# Altium project Flight_controller v1.0.PrjPcb (part 3 of 3)

## Sheet Sensors.SchDoc
size A3; SheetNumber: 5; SheetTotal: 5
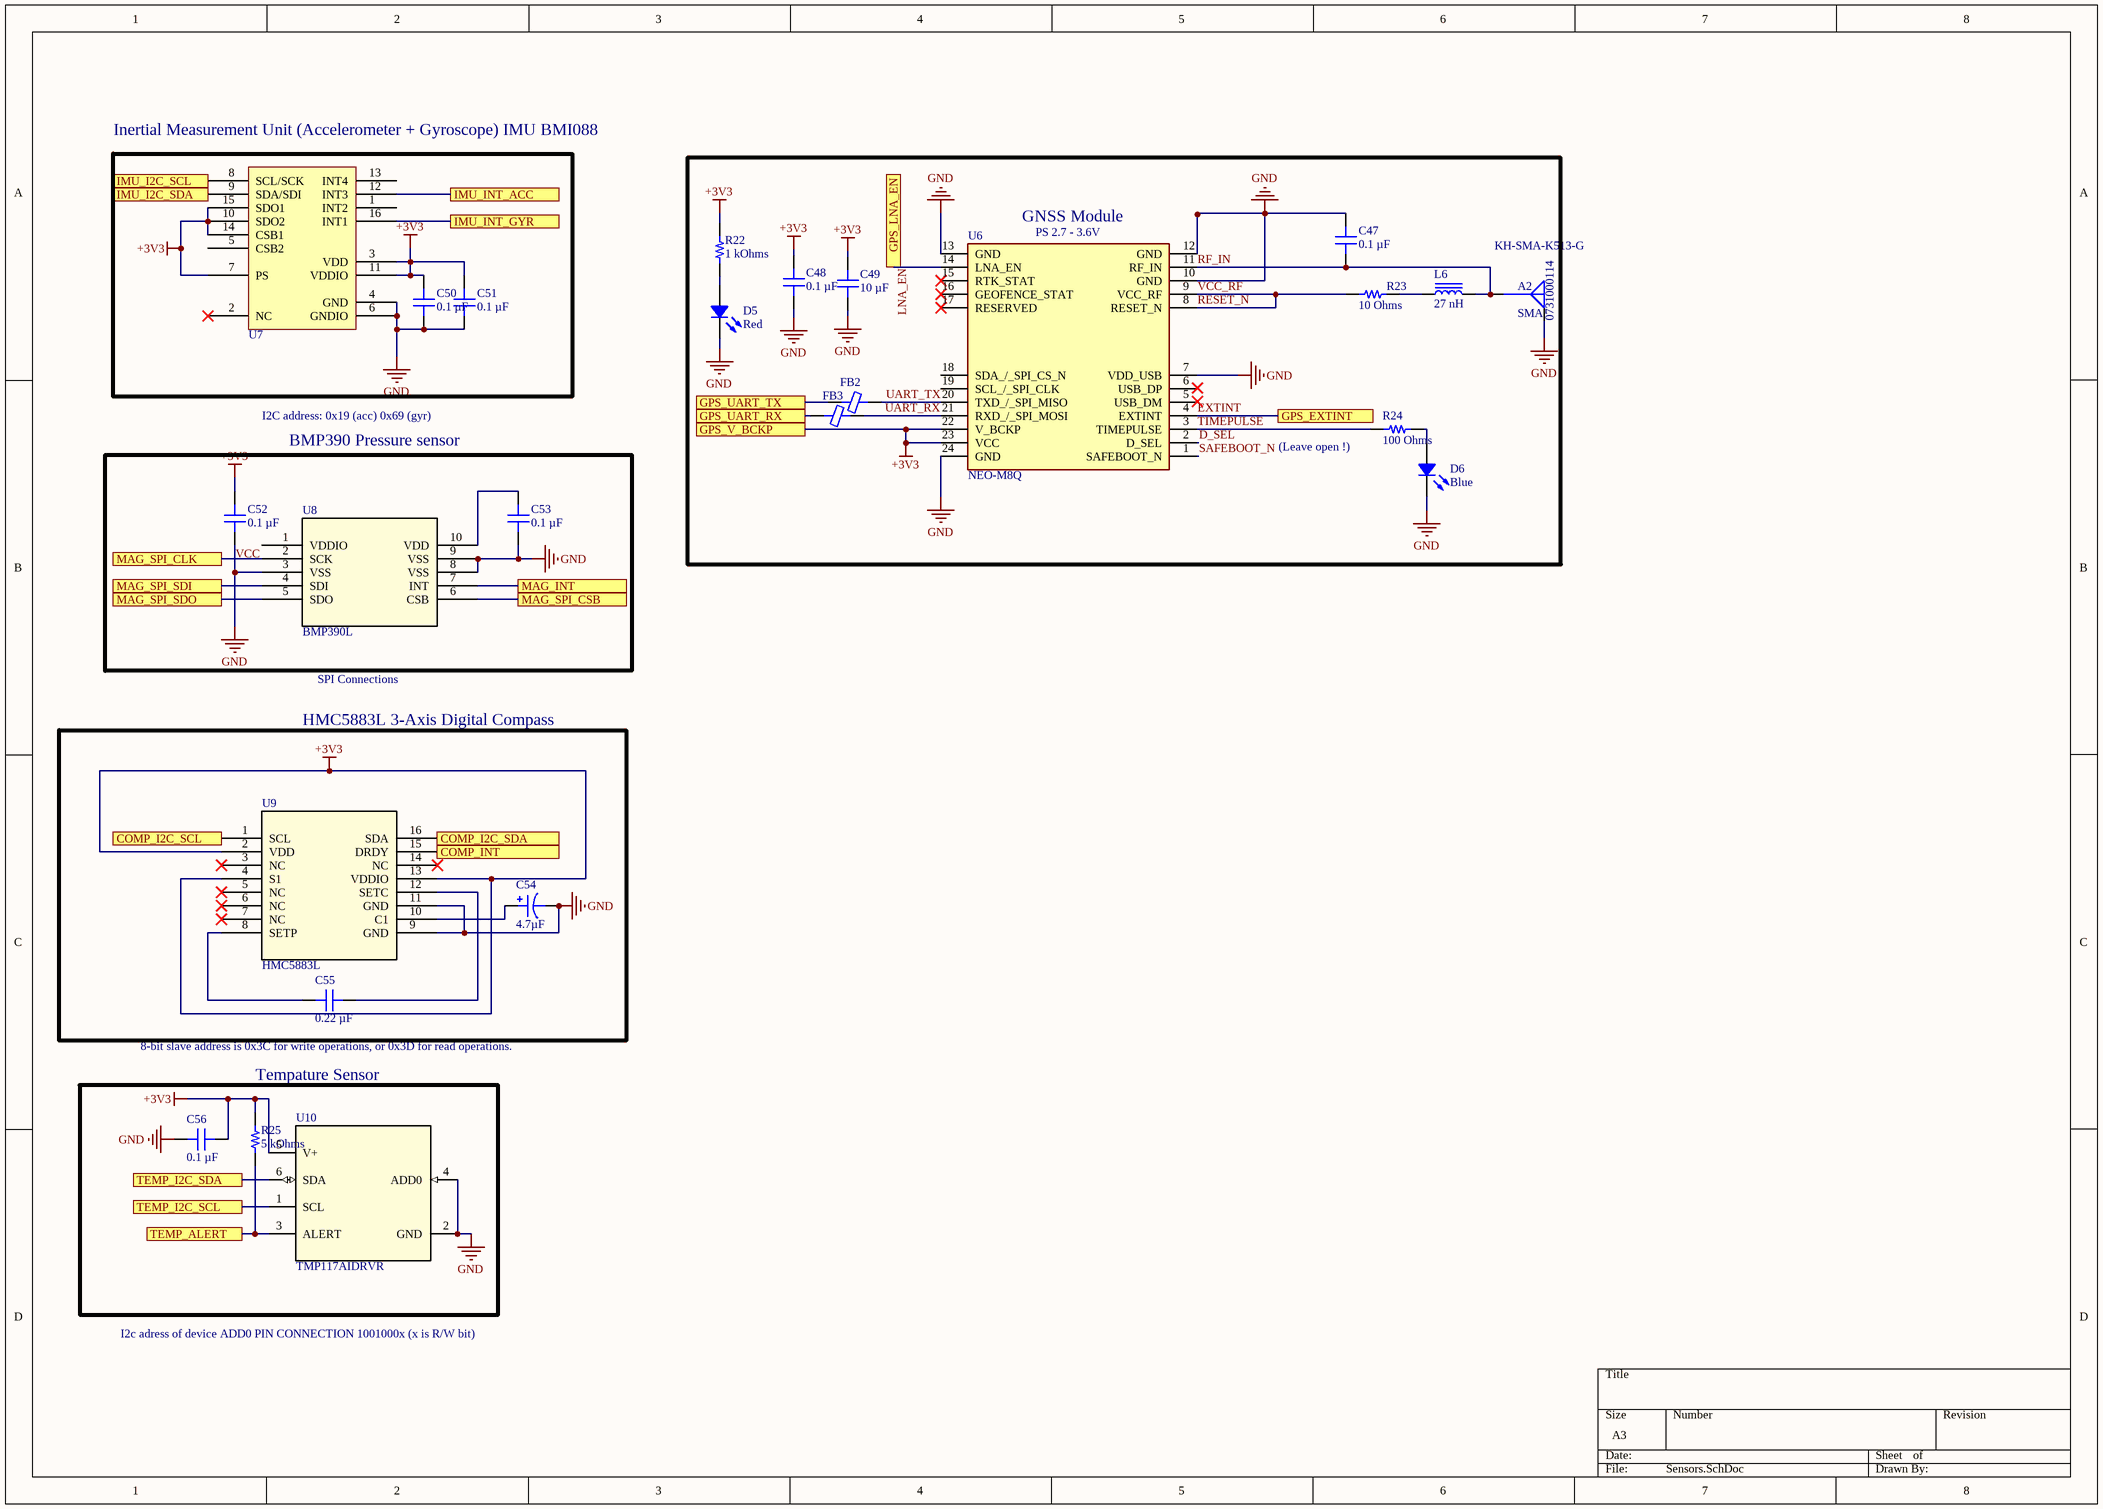
[diagram p3: Sensors.SchDoc]

### Parts
A2  0731000114  Connector Style: SMA  [MOLEX SD-73100-0114]
C47  0.1 µF  [CAP 0402_1005]
C48  0.1 µF  [CAP 0603_1608]
C49  10 µF  [CAP 1210_3225 - 1MM]
C50  value 0.1 µF  [CAP 1206_3216 - 1.8MM]  (hidden comment: 22µF)
C51  0.1 µF  [CAP 0603_1608]
C52  value 0.1 µF  [CAP 0603_1608]  (hidden comment: 220 pF)
C53  value 0.1 µF  [CAP 0603_1608]  (hidden comment: 1 µF)
C54  4.7µF  [CAP POL 1206_3216]
C55  value 0.22 µF  [CAP 0603_1608]  (hidden comment: 10000 pF)
C56  0.1 µF  [CAP 0603_1608]
D5  Red  [LED 0805_2012 RED]
D6  Blue  [LED 0603_1608 BLUE]
FB2  1 kOhms @ 100 MHz  [FER 0402_1005]  (value not drawn)
FB3  1 kOhms @ 100 MHz  [FER 0402_1005]  (value not drawn)
L6  27 nH  [IND 0402_1005]
R22  1 kOhms  [RES 0603_1608]
R23  10 Ohms  [RES 0402_1005]
R24  100 Ohms  [RES 0603_1608]
R25  5 kOhms  [RES 0603_1608]
U6  NEO-M8Q  [NEO-M8U]
U7  BMI088_2  [QFN_BMI085_BOS]  (value not drawn)
U8  BMP390L  [BMP390L_BOS]
U9  HMC5883L  [LPCC16_HNW]
U10  TMP117AIDRVR  [DRV0006B]

### Blocks framed on the sheet
GNSS Module: A2 C47-C49 D5 D6 FB2 FB3 L6 R22-R24 U6
BMP390 Pressure sensor: C52 C53 U8
HMC5883L 3-Axis Digital Compass: C54 C55 U9
Tempature Sensor: C56 R25 U10

### Ports
COMP_I2C_SCL, COMP_I2C_SDA, COMP_INT, GPS_EXTINT, GPS_LNA_EN, GPS_UART_RX, GPS_UART_TX, GPS_V_BCKP, IMU_I2C_SCL, IMU_I2C_SDA, IMU_INT_ACC, IMU_INT_GYR, MAG_INT, MAG_SPI_CLK, MAG_SPI_CSB, MAG_SPI_SDI, MAG_SPI_SDO, TEMP_ALERT, TEMP_I2C_SCL, TEMP_I2C_SDA

### Nets
+3V3: C48.2 C49.2 C50.2 C51.2 C52.2 C56.1 R22.2 R25.2 U6.22(V_BCKP) U6.23(VCC) U7.3(VDD) U7.7(PS) U7.10(SDO2) U7.11(VDDIO) U7.14(CSB1) U7.15(SDO1) U9.2(VDD) U9.4(S1) U9.13(VDDIO) U10.5(V+) ; port GPS_V_BCKP
GND: A2.G C47.2 C48.1 C49.1 C50.1 C51.1 C52.1 C53.1 C54.2 C56.2 D5.2 D6.2 U6.7(VDD_USB) U6.10(GND) U6.12(GND) U6.13(GND) U6.24(GND) U7.4(GND) U7.6(GNDIO) U8.3(VSS) U8.8(VSS) U8.9(VSS) U9.9(GND) U9.11(GND) U10.2(GND) U10.4(ADD0)
D_SEL: U6.2(D_SEL)
EXTINT: U6.4(EXTINT) ; port GPS_EXTINT
I2C1_SCA: U7.9(SDA/SDI) U9.16(SDA) ; port IMU_I2C_SDA, port COMP_I2C_SDA
I2C1_SCL: U7.8(SCL/SCK) U9.1(SCL) ; port IMU_I2C_SCL, port COMP_I2C_SCL
LNA_EN: U6.14(LNA_EN) ; port GPS_LNA_EN
PF0: U10.6(SDA) ; port TEMP_I2C_SDA
PF1: U10.1(SCL) ; port TEMP_I2C_SCL
PF2: R25.1 U10.3(ALERT) ; port TEMP_ALERT
PF9: U7.16(INT1) ; port IMU_INT_GYR
PF10: U7.12(INT3) ; port IMU_INT_ACC
PF11: U8.7(INT) ; port MAG_INT
PF12: U9.15(DRDY) ; port COMP_INT
RESET_N: R23.1 U6.8(RESET_N) U6.9(VCC_RF)  [also labelled VCC_RF]
RF_IN: A2.S C47.1 L6.2 U6.11(RF_IN)
SAFEBOOT_N: U6.1(SAFEBOOT_N)
TIMEPULSE: R24.2 U6.3(TIMEPULSE)
UART_RX: FB3.2 U6.21(RXD_/_SPI_MOSI)
UART_TX: FB2.2 U6.20(TXD_/_SPI_MISO)
USART2_RX: FB2.1 ; port GPS_UART_TX
USART2_TX: FB3.1 ; port GPS_UART_RX
VCC: U8.1(VDDIO)
NetC53_2: C53.2 U8.10(VDD)
NetC54_1: C54.1 U9.10(C1)
NetC55_1: C55.1 U9.8(SETP)
NetC55_2: C55.2 U9.12(SETC)
NetD5_1: D5.1 R22.1
NetD6_1: D6.1 R24.1
NetL6_1: L6.1 R23.2
NetU8_2: U8.2(SCK) ; port MAG_SPI_CLK
NetU8_4: U8.4(SDI) ; port MAG_SPI_SDI
NetU8_5: U8.5(SDO) ; port MAG_SPI_SDO
NetU8_6: U8.6(CSB) ; port MAG_SPI_CSB

Not connected (* = marked no-connect by the designer): U6 5(USB_DM) 6(USB_DP) 15(RTK_STAT)* 16(GEOFENCE_STAT)* 17(RESERVED)* 18(SDA_/_SPI_CS_N) 19(SCL_/_SPI_CLK); U7 1(INT2) 2(NC)* 5(CSB2) 13(INT4); U9 3(NC)* 5(NC)* 6(NC)* 7(NC)* 14(NC)*

### Notes on the sheet
- (near U7) Inertial Measurement Unit (Accelerometer + Gyroscope) IMU BMI088
- (near U6) PS 2.7 - 3.6V
- KH-SMA-K513-G
- I2C address: 0x19 (acc) 0x69 (gyr)
- (near R24) (Leave open !)
- SPI Connections
- (near C55) 8-bit slave address is 0x3C for write operations, or 0x3D for read operations.
- I2c adress of device ADD0 PIN CONNECTION 1001000x (x is R/W bit)

### Library data of the parts
A2 = 0731000114: CONN SMA RCPT R/A 50 OHM PCB; Manufacturer: Molex; Connector Type: Receptacle, Female Socket; Contact Termination: Solder; Frequency - Max: 18 GHz; Impedance: 50Ohm; Number of Ports: 1; Part Number: 0731000114; ComponentLink1Description: Datasheet; ComponentLink1URL: https://www.molex.com/pdm_docs/sd/731000114_sd.pdf; ComponentLink2Description: DigiKey Link; ComponentLink2URL: https://www.digikey.com/en/products/detail/molex/0731000114/1465147; Fastening Type: Threaded; Housing Color: Gold; LastUpdated: 29.06.2022 18:00:24; Lifecycle Status: Active; Minimum Order: 1; Mounting Type: Through Hole, Right Angle; Packaging: Tray; Part Status: Active; Price: 3.19; Series: 73100; Shield Termination: Solder; Supplier 1: DigiKey; Supplier Part Number 1: WM5525-ND
C47 = CL05B104KO5NNNC: CAP CER 0.1UF 16V X7R 0402; manufacturer: Samsung Electro-Mechanics; Tolerance: ±10%; Part Number: CL05B104KO5NNNC; Value: 0.1 µF; Applications: General Purpose; Capacitance: 0.1 µF; componentlink1description: Datasheet; componentlink1url: http://www.samsungsem.com/kr/support/product-search/mlcc/CL05B104KO5NNNC.jsp; componentlink2description: DigiKey Link; componentlink2url: https://www.digikey.com/en/products/detail/samsung-electro-mechanics/CL05B104KO5NNNC/3886659; Device Package: 0402 (1005 Metric); lastupdated: 3.03.2023 20:04:29; Lifecycle Status: Active; Minimum Order: 1; Mounting Type: Surface Mount, MLCC; Operating Temperature: -55°C ~ 125°C; Package / Case: 0402 (1005 Metric); packaging: CutTape; partid: 6066; Part Status: Active; price: 0.01; series: CL; Size / Dimension: 0.039" L x 0.020" W (1.00mm x 0.50mm); Supplier 1: DigiKey; Supplier Part Number 1: 1276-1001-1-ND; Temperature Coefficient: X7R; Thickness (Max): 0.022" (0.55mm); Voltage - Rated: 16V
C48 = CC0603KRX7R6BB104: CAP CER 0.1UF 10V X7R 0603; manufacturer: Yageo; Tolerance: ±10%; Part Number: CC0603KRX7R6BB104; Value: 0.1 µF; Applications: General Purpose; Capacitance: 0.1 µF; componentlink1description: Datasheet; componentlink1url: https://www.yageo.com/upload/media/product/productsearch/datasheet/mlcc/UPY-GPHC_X7R_6.3V-to-50V_18.pdf; componentlink2description: DigiKey Link; componentlink2url: https://www.digikey.com/en/products/detail/yageo/CC0603KRX7R6BB104/5883741; Device Package: 0603 (1608 Metric); lastupdated: 7.03.2023 20:08:13; Lifecycle Status: Active; Minimum Order: 1; Mounting Type: Surface Mount, MLCC; Operating Temperature: -55°C ~ 125°C; Package / Case: 0603 (1608 Metric); packaging: TapeAndReel; partid: 7937; Part Status: Active; price: 0.01; series: CC; Size / Dimension: 0.063" L x 0.031" W (1.60mm x 0.80mm); Supplier 1: DigiKey; Supplier Part Number 1: 311-4055-1-ND; Temperature Coefficient: X7R; Thickness (Max): 0.035" (0.90mm); Voltage - Rated: 10V
C49 = EMK325BJ106KN-T: CAP CER 10UF 16V X5R 1210; manufacturer: Taiyo Yuden; Tolerance: ±10%; Part Number: EMK325BJ106KN-T; Value: 10 µF; Applications: SMPS Filtering; Capacitance: 10 µF; componentlink1description: Datasheet; componentlink1url: http://www.yuden.co.jp/productdata/catalog/mlcc06_e.pdf; componentlink2description: DigiKey Link; componentlink2url: https://www.digikey.com/en/products/detail/taiyo-yuden/EMK325BJ106KN-T/930729; Device Package: 1210 (3225 Metric); lastupdated: 7.03.2023 20:30:00; Lifecycle Status: Active; Minimum Order: 1; Mounting Type: Surface Mount, MLCC; Operating Temperature: -55°C ~ 85°C; Package / Case: 1210 (3225 Metric); packaging: TapeAndReel; partid: 47465; Part Status: Active; price: 0.07; series: M; Size / Dimension: 0.126" L x 0.098" W (3.20mm x 2.50mm); Supplier 1: DigiKey; Supplier Part Number 1: 587-1376-1-ND; Temperature Coefficient: X5R; Thickness (Max): 0.083" (2.10mm); Voltage - Rated: 16V
C50-C53 = CL10B104KO8NNNC: CAP CER 0.1UF 16V X7R 0603; manufacturer: Samsung Electro-Mechanics; Tolerance: ±10%; Part Number: CL10B104KO8NNNC; Applications: General Purpose; Capacitance: 0.1 µF; componentlink1description: Datasheet; componentlink1url: http://www.samsungsem.com/kr/support/product-search/mlcc/CL10B104KO8NNNC.jsp; componentlink2description: DigiKey Link; componentlink2url: https://www.digikey.com/en/products/detail/samsung-electro-mechanics/CL10B104KO8NNNC/3886663; Device Package: 0603 (1608 Metric); lastupdated: 28.02.2023 20:08:16; Lifecycle Status: Active; Minimum Order: 1; Mounting Type: Surface Mount, MLCC; Operating Temperature: -55°C ~ 125°C; Package / Case: 0603 (1608 Metric); packaging: TapeAndReel; partid: 9791; Part Status: Active; price: 0.01; series: CL; Size / Dimension: 0.063" L x 0.031" W (1.60mm x 0.80mm); Supplier 1: DigiKey; Supplier Part Number 1: 1276-1005-1-ND; Temperature Coefficient: X7R; Thickness (Max): 0.035" (0.90mm); Voltage - Rated: 16V
  C51: Value: 0.1 µF
C54 = TAJA475K016RNJ: CAP TANT 4.7UF 10% 16V 1206; manufacturer: AVX Corporation; Manufacturer Size Code: A; ESR (Equivalent Series Resistance): 4Ohm; Type: Molded; Part Number: TAJA475K016RNJ; Value: 4.7µF; Capacitance: 4.7µF; componentlink1description: Datasheet; componentlink1url: http://datasheets.avx.com/TAJ.pdf; componentlink2description: DigiKey Link; componentlink2url: http://digikey.com/product-detail/en/avx-corporation/TAJA475K016RNJ/478-3868-1-ND/1126914; Device Package: 1206 (3216 Metric); Features: General Purpose; Height - Seated (Max): 0.071" (1.80mm); lastupdated: 2.09.2020 01:15:58; Lifecycle Status: Active; Minimum Order: 1; Mounting Type: Surface Mount; Operating Temperature: -55°C ~ 125°C; Package / Case: 1206 (3216 Metric); packaging: TapeAndReel; partid: 328; Part Status: Active; price: 0.09; series: TAJ; Size / Dimension: 0.126" L x 0.063" W (3.20mm x 1.60mm); Supplier 1: DigiKey; Supplier Part Number 1: 478-3868-1-ND; Tolerance: ±10%; Voltage - Rated: 16V
C55 = CL05A224KP5NNNC: CAP CER 0.22UF 10V X5R 0402; manufacturer: Samsung Electro-Mechanics; Tolerance: ±10%; Part Number: CL05A224KP5NNNC; Applications: General Purpose; Capacitance: 0.22 µF; componentlink1description: Datasheet; componentlink1url: http://www.samsungsem.com/kr/support/product-search/mlcc/CL05A224KP5NNNC.jsp; componentlink2description: DigiKey Link; componentlink2url: https://www.digikey.com/en/products/detail/samsung-electro-mechanics/CL05A224KP5NNNC/3886707; Device Package: 0402 (1005 Metric); lastupdated: 28.02.2023 20:04:39; Lifecycle Status: Active; Minimum Order: 1; Mounting Type: Surface Mount, MLCC; Operating Temperature: -55°C ~ 85°C; Package / Case: 0402 (1005 Metric); packaging: TapeAndReel; partid: 3132; Part Status: Active; price: 0.01; series: CL; Size / Dimension: 0.039" L x 0.020" W (1.00mm x 0.50mm); Supplier 1: DigiKey; Supplier Part Number 1: 1276-1049-1-ND; Temperature Coefficient: X5R; Thickness (Max): 0.022" (0.55mm); Voltage - Rated: 10V
C56 = CC0603KRX7R7BB104: CAP CER 0.1UF 16V X7R 0603; manufacturer: Yageo; Tolerance: ±10%; Part Number: CC0603KRX7R7BB104; Value: 0.1 µF; Applications: General Purpose; Capacitance: 0.1 µF; componentlink1description: Datasheet; componentlink1url: https://www.yageo.com/upload/media/product/productsearch/datasheet/mlcc/UPY-GPHC_X7R_6.3V-to-50V_18.pdf; componentlink2description: DigiKey Link; componentlink2url: https://www.digikey.com/en/products/detail/yageo/CC0603KRX7R7BB104/302822; Device Package: 0603 (1608 Metric); lastupdated: 4.08.2022 04:29:59; Lifecycle Status: Active; Minimum Order: 1; Mounting Type: Surface Mount, MLCC; Operating Temperature: -55°C ~ 125°C; Package / Case: 0603 (1608 Metric); packaging: TapeAndReel; partid: 16746; Part Status: Active; price: 0.01; series: CC; Size / Dimension: 0.063" L x 0.031" W (1.60mm x 0.80mm); Supplier 1: DigiKey; Supplier Part Number 1: 311-1088-1-ND; Temperature Coefficient: X7R; Thickness (Max): 0.035" (0.90mm); Voltage - Rated: 16V
D5 = LTST-C170KRKT: LED RED CLEAR SMD; Manufacturer: Lite-On Inc.; Configuration: Standard; Current - Test: 20mA; Lens Color: Colorless; Lens Size: 1.40mm x 1.25mm; Lens Style: Rectangle with Flat Top; Millicandela Rating: 54mcd; Viewing Angle: 130°; Voltage - Forward (Vf) (Typ): 2V; Wavelength - Dominant: 631nm; Wavelength - Peak: 639nm; Part Number: LTST-C170KRKT; Color: Red; ComponentLink1Description: Datasheet; ComponentLink1URL: http://optoelectronics.liteon.com/upload/download/DS-22-99-0150/LTST-C170KRKT.pdf; ComponentLink2Description: DigiKey Link; ComponentLink2URL: http://digikey.com/product-detail/en/lite-on-inc/LTST-C170KRKT/160-1415-1-ND/386778; Device Package: 0805 (2012 Metric); Height (Max): 1.10mm; LastUpdated: 7.03.2023 20:55:45; Lens Transparency: Clear; Lifecycle Status: Active; Minimum Order: 1; Mounting Type: Surface Mount; Package / Case: 0805 (2012 Metric); Packaging: TapeAndReel; PartId: 350; Part Status: Active; Price: 0.06; Series: -; Size / Dimension: 2.00mm L x 1.25mm W; Supplier 1: DigiKey; Supplier Part Number 1: 160-1415-1-ND; Value: Red
D6 = LTST-C190TBKT: LED BLUE CLEAR CHIP SMD; Manufacturer: Lite-On Inc.; Configuration: Standard; Current - Test: 20mA; Lens Color: Colorless; Lens Size: 1.10mm x 0.80mm; Lens Style: Rectangle with Flat Top; Millicandela Rating: 104mcd; Viewing Angle: 130°; Voltage - Forward (Vf) (Typ): 3.3V; Wavelength - Dominant: 470nm; Wavelength - Peak: 468nm; Part Number: LTST-C190TBKT; Color: Blue; ComponentLink1Description: Datasheet; ComponentLink1URL: http://optoelectronics.liteon.com/upload/download/DS-22-99-0224/LTST-C190TBKT.PDF; ComponentLink2Description: DigiKey Link; ComponentLink2URL: http://digikey.com/product-detail/en/lite-on-inc/LTST-C190TBKT/160-1646-1-ND/573586; Device Package: 0603 (1608 Metric); Height (Max): 0.90mm; LastUpdated: 5.03.2023 20:55:19; Lens Transparency: Clear; Lifecycle Status: Active; Minimum Order: 1; Mounting Type: Surface Mount; Package / Case: 0603 (1608 Metric); Packaging: TapeAndReel; PartId: 831; Part Status: Active; Price: 0.08; Series: -; Size / Dimension: 1.60mm L x 0.80mm W; Supplier 1: DigiKey; Supplier Part Number 1: 160-1646-1-ND; Supplier Device Package: Chip LED; Value: Blue
FB2 FB3 = BLM15AX102SN1D: FERRITE BEAD 1K OHM 0402 1LN; Manufacturer: Murata Electronics; Current Rating (Max): 350mA; DC Resistance (DCR) (Max): 490mOhm; Number of Lines: 1; Part Number: BLM15AX102SN1D; ComponentLink1Description: Datasheet; ComponentLink1URL: https://www.murata.com/en-us/products/productdata/8796740059166/ENFA0018.pdf; ComponentLink2Description: DigiKey Link; ComponentLink2URL: https://www.digikey.com/en/products/detail/murata-electronics/BLM15AX102SN1D/2256877; Device Package: 0402 (1005 Metric); Height (Max): 0.022" (0.55mm); Impedance @ Frequency: 1 kOhms @ 100 MHz; LastUpdated: 7.03.2023 20:49:02; Lifecycle Status: Active; Minimum Order: 1; Mounting Type: Surface Mount; Operating Temperature: -55°C ~ 125°C; Package / Case: 0402 (1005 Metric); Packaging: TapeAndReel; PartId: 398; Part Status: Active; Price: 0.01; Series: EMIFIL®, BLM15; Size / Dimension: 0.039" L x 0.022" W (1.00mm x 0.55mm); Supplier 1: DigiKey; Supplier Part Number 1: 490-5442-1-ND; Value: 1 kOhms @ 100 MHz
L6 = LQG15HS27NJ02D: FIXED IND 27NH 350MA 460MOHM SMD; Manufacturer: Murata Electronics; DC Resistance (DCR): 460mOhm Max; Frequency - Self Resonant: 1.7GHz; Inductance Frequency - Test: 100 MHz; Material - Core: Air; Q @ Freq: 8 @ 100MHz; Shielding: Unshielded; Tolerance: ±5%; Type: Multilayer; Part Number: LQG15HS27NJ02D; ComponentLink1Description: Datasheet; ComponentLink1URL: https://search.murata.co.jp/Ceramy/image/img/P02/JELF243B-0010.pdf; ComponentLink2Description: DigiKey Link; ComponentLink2URL: https://www.digikey.com/en/products/detail/murata-electronics/LQG15HS27NJ02D/662877; Current Rating (Amps): 350 mA; Device Package: 0402 (1005 Metric); Height - Seated (Max): 0.022" (0.55mm); Inductance: 27 nH; LastUpdated: 7.03.2023 21:02:57; Lifecycle Status: Active; Minimum Order: 1; Mounting Type: Surface Mount; Operating Temperature: -55°C ~ 125°C; Package / Case: 0402 (1005 Metric); Packaging: TapeAndReel; PartId: 1475; Part Status: Active; Price: 0.02; Series: LQG15; Size / Dimension: 0.039" L x 0.020" W (1.00mm x 0.50mm); Supplier 1: DigiKey; Supplier Part Number 1: 490-2628-1-ND; Supplier Device Package: 0402 (1005 Metric); Value: 27 nH
R22 = RC0603FR-071KL: RES SMD 1K OHM 1% 1/10W 0603; Manufacturer: Yageo; Power (Watts): 0.1W, 1/10W; Temperature Coefficient: ±100ppm/°C; Part Number: RC0603FR-071KL; Value: 1 kOhms; ComponentLink1Description: Datasheet; ComponentLink1URL: https://www.yageo.com/upload/media/product/productsearch/datasheet/rchip/PYu-RC_Group_51_RoHS_L_10.pdf; ComponentLink2Description: DigiKey Link; ComponentLink2URL: http://digikey.com/product-detail/en/yageo/RC0603FR-071KL/311-1.00KHRCT-ND/729790; Composition: Thick Film; Device Package: 0603 (1608 Metric); Features: Moisture Resistant; Height - Seated (Max): 0.022" (0.55mm); LastUpdated: 2.09.2020 01:09:45; Lifecycle Status: Active; Minimum Order: 1; Number of Terminations: 2; Operating Temperature: -55°C ~ 155°C; Package / Case: 0603 (1608 Metric); Packaging: CutTape; PartId: 22600; Part Status: Active; Price: 0.10; Resistance: 1 kOhms; Series: RC; Size / Dimension: 0.063" L x 0.031" W (1.60mm x 0.80mm); Supplier 1: DigiKey; Supplier Part Number 1: 311-1.00KHRCT-ND; Supplier Device Package: 0603; Tolerance: ±1%
R23 = ERA-2AKD100X: RES SMD 10 OHM 0.5% 1/16W 0402; Manufacturer: Panasonic Electronic Components; Power (Watts): 0.063W, 1/16W; Temperature Coefficient: ±100ppm/°C; Part Number: ERA-2AKD100X; Value: 10 Ohms; ComponentLink1Description: Datasheet; ComponentLink1URL: https://industrial.panasonic.com/cdbs/www-data/pdf/RDM0000/AOA0000C307.pdf; ComponentLink2Description: DigiKey Link; ComponentLink2URL: http://digikey.com/product-detail/en/panasonic-electronic-components/ERA-2AKD100X/P10DDCT-ND/1706232; Composition: Thin Film; Device Package: 0402 (1005 Metric); Features: Automotive AEC-Q200; Height - Seated (Max): 0.016" (0.40mm); LastUpdated: 2.09.2020 01:08:09; Lifecycle Status: Active; Minimum Order: 1; Number of Terminations: 2; Operating Temperature: -55°C ~ 155°C; Package / Case: 0402 (1005 Metric); Packaging: TapeAndReel; PartId: 3168; Part Status: Active; Price: 0.01; Ratings: AEC-Q200; Resistance: 10 Ohms; Series: ERA-2A; Size / Dimension: 0.039" L x 0.020" W (1.00mm x 0.50mm); Supplier 1: DigiKey; Supplier Part Number 1: P10DDCT-ND; Supplier Device Package: 0402; Tolerance: ±0.5%
R24 = RK73G1JTTD1000F: RES 100 OHM 1% 1/10W 0603; Manufacturer: KOA Speer Electronics, Inc.; Power (Watts): 0.1W, 1/10W; Temperature Coefficient: ±50ppm/°C; Part Number: RK73G1JTTD1000F; Value: 100 Ohms; ComponentLink1Description: Datasheet; ComponentLink1URL: https://www.koaspeer.com/pdfs/RK73G.pdf; ComponentLink2Description: DigiKey Link; ComponentLink2URL: https://www.digikey.com/en/products/detail/koa-speer-electronics-inc/RK73G1JTTD1000F/9854468; Composition: Thick Film; Device Package: 0603 (1608 Metric); Features: Automotive AEC-Q200; Height - Seated (Max): 0.022" (0.55mm); LastUpdated: 5.03.2023 20:27:16; Lifecycle Status: Active; Minimum Order: 1; Number of Terminations: 2; Operating Temperature: -55°C ~ 155°C; Package / Case: 0603 (1608 Metric); Packaging: TapeAndReel; PartId: 65534; Part Status: Active; Price: 0.03; Ratings: AEC-Q200; Resistance: 100 Ohms; Series: RK73G; Size / Dimension: 0.063" L x 0.031" W (1.60mm x 0.80mm); Supplier 1: DigiKey; Supplier Part Number 1: 2019-RK73G1JTTD1000FCT-ND; Supplier Device Package: 0603; Tolerance: ±1%
R25 = RT0603BRE075KL: RES 5K OHM 0.1% 1/10W 0603; Manufacturer: Yageo; Power (Watts): 0.1W, 1/10W; Temperature Coefficient: ±50ppm/°C; Part Number: RT0603BRE075KL; Value: 5 kOhms; ComponentLink1Description: Datasheet; ComponentLink1URL: https://www.yageo.com/upload/media/product/productsearch/datasheet/rchip/PYu-RT_1-to-0.01_RoHS_L_12.pdf; ComponentLink2Description: DigiKey Link; ComponentLink2URL: https://www.digikey.com/en/products/detail/yageo/RT0603BRE075KL/7708365; Composition: Thin Film; Device Package: 0603 (1608 Metric); Height - Seated (Max): 0.022" (0.55mm); LastUpdated: 21.08.2022 20:20:42; Lifecycle Status: Active; Minimum Order: 1; Number of Terminations: 2; Operating Temperature: -55°C ~ 155°C; Package / Case: 0603 (1608 Metric); Packaging: TapeAndReel; PartId: 67915; Part Status: Active; Price: 0.05; Resistance: 5 kOhms; Series: RT; Size / Dimension: 0.063" L x 0.031" W (1.60mm x 0.80mm); Supplier 1: DigiKey; Supplier Part Number 1: 13-RT0603BRE075KLCT-ND; Supplier Device Package: 0603; Tolerance: ±0.1%
U6 = NEO-M8P-2: Integrated Circuit; Manufacturer_Name: U-Blox; Datasheet Link: https://datasheet.datasheetarchive.com/originals/distributors/DKDS-37/730172.pdf; Manufacturer_Part_Number: NEO-M8P-2; Mouser Part Number: 377-NEO-M8P-2; Mouser Price/Stock: https://www.mouser.co.uk/ProductDetail/u-blox/NEO-M8P-2?qs=zW32dvEIR3um1owIgR0I3w%3D%3D
U8 = BMP390L: No Description Available; Mfr_Name: Bosch Sensortec; Copyright: Copyright (C) 2022 Ultra Librarian. All rights reserved.; Manufacturer_Part_Number: BMP390L; RefDes: RefDes; Type: DEV
U9 = HMC5883L: No Description Available; Mfr_Name: Honeywell; Copyright: Copyright (C) 2022 Ultra Librarian. All rights reserved.; Manufacturer_Part_Number: HMC5883L; RefDes: RefDes; Type: DEV
U10 = TMP117AIDRVR: No Description Available; Mfr_Name: Texas Instruments; Type: DEV; RefDes: RefDes; Copyright: Copyright (C) 2022 Ultra Librarian. All rights reserved.; Manufacturer_Part_Number: TMP117AIDRVR

## Sheet LoRa-SX1281.SchDoc
size A3; SheetNumber: 4; SheetTotal: 5
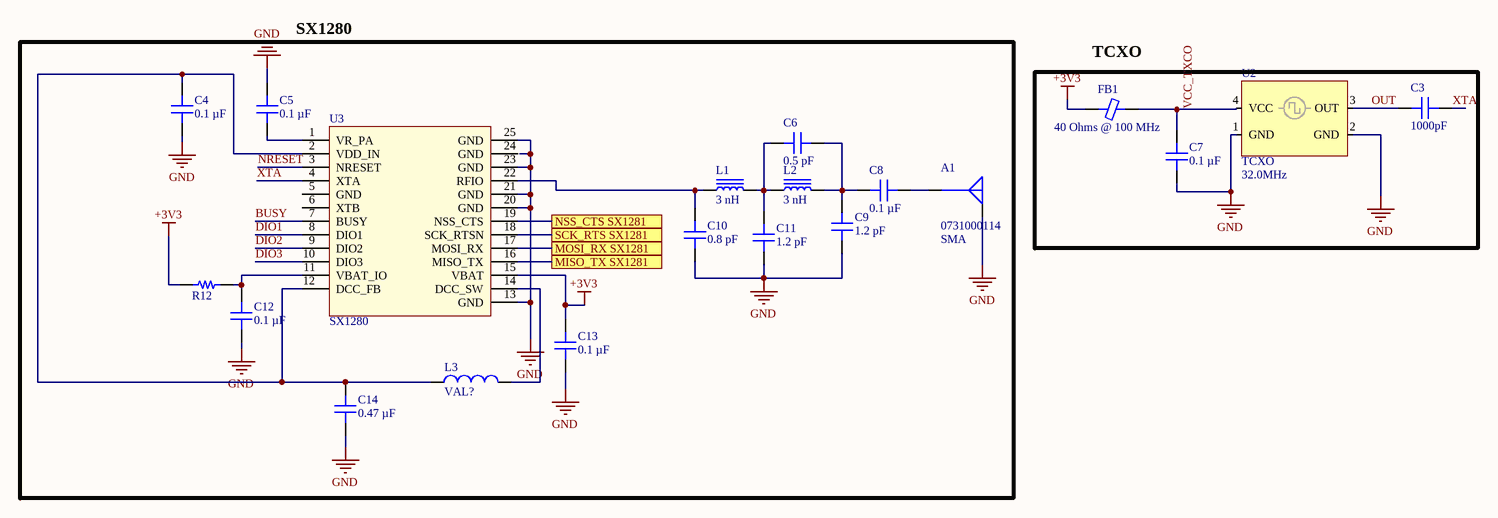
[diagram p4: LoRa-SX1281.SchDoc]

### Parts
A1  0731000114  Connector Style: SMA  [MOLEX SD-73100-0114]
C3  1000pF  [CAP 0402_1005]
C4  0.1 µF  [CAP 0402_1005]
C5  0.1 µF  [CAP 0402_1005]
C6  value 0.5 pF  [CAP 0402_1005]  (hidden comment: 0.5pF)
C7  value 0.1 µF  [CAP 0402_1005]  (hidden comment: 0.1µF)
C8  value 0.1 µF  [CAP 0402_1005]  (hidden comment: 0.1µF)
C9  1.2 pF  [CAP 0402_1005]
C10  value 0.8 pF  [CAP 0402_1005]  (hidden comment: 1.2 pF)
C11  value 1.2 pF  [CAP 0402_1005]  (hidden comment: 0.8pF)
C12  value 0.1 µF  [CAP 0402_1005]  (hidden comment: 0.1µF)
C13  value 0.1 µF  [CAP 0402_1005]  (hidden comment: 0.1µF)
C14  0.47 µF  [CAP 0402_1005]
FB1  40 Ohms @ 100 MHz  [FER 0402_1005]
L1  3 nH  [IND 0402_1005]
L2  3 nH  [IND 0402_1005]
L3  value VAL?  [rlc_805_smd]  (hidden comment: Inductor)
R12  (no value)  [RES 0402_1005]
U2  TCXO  value 32.0MHz  [TCXO 2.0x1.6mm]
U3  SX1280  [vqfn24_4x4mm]

### Blocks framed on the sheet
SX1280: A1 C4-C6 C8-C14 L1-L3 R12 U3
TCXO: C3 C7 FB1 U2

### Ports
MISO_TX SX1281, MOSI_RX SX1281, NSS_CTS SX1281, SCK_RTS SX1281

### Nets
+3V3: C13.2 FB1.1 R12.1 U3.15(VBAT)
GND: A1.G C4.1 C5.1 C7.1 C9.1 C10.1 C11.1 C12.1 C13.1 C14.1 U2.1(GND) U2.2(GND) U3.13(GND) U3.20(GND) U3.21(GND) U3.23(GND) U3.25(GND)
BUSY: U3.7(BUSY)
DIO1: U3.8(DIO1)
DIO2: U3.9(DIO2)
DIO3: U3.10(DIO3)
NRESET: U3.3(NRESET)
OUT: C3.2 U2.3(OUT)
PA5: U3.18(SCK_RTSN) ; port SCK_RTS SX1281
PB4: U3.16(MISO_TX) ; port MISO_TX SX1281
PB5: U3.17(MOSI_RX) ; port MOSI_RX SX1281
PF13: U3.19(NSS_CTS) ; port NSS_CTS SX1281
VCC_TXCO: C7.2 FB1.2 U2.4(VCC)
XTA: C3.1 U3.4(XTA)
NetA1_S: A1.S C8.1
NetC4_2: C4.2 C14.2 L3.1 U3.2(VDD_IN) U3.12(DCC_FB)
NetC5_2: C5.2 U3.1(VR_PA)
NetC6_1: C6.1 C11.2 L1.2 L2.1
NetC6_2: C6.2 C8.2 C9.2 L2.2
NetC10_2: C10.2 L1.1 U3.22(RFIO)
NetC12_2: C12.2 R12.2 U3.11(VBAT_IO)
NetL3_2: L3.2 U3.14(DCC_SW)

Not connected (* = marked no-connect by the designer): U3 5(GND) 6(XTB) 24(GND)

### Library data of the parts
A1 = 0731000114: as A2 on sheet Sensors; Part Number: 0731000114; ComponentLink1Description: Datasheet; ComponentLink1URL: https://www.molex.com/pdm_docs/sd/731000114_sd.pdf; ComponentLink2Description: DigiKey Link; ComponentLink2URL: https://www.digikey.com/en/products/detail/molex/0731000114/1465147; Fastening Type: Threaded; Housing Color: Gold; LastUpdated: 29.06.2022 18:00:24; Lifecycle Status: Active; Minimum Order: 1; Mounting Type: Through Hole, Right Angle; Packaging: Tray; Part Status: Active; Price: 3.19; Series: 73100; Shield Termination: Solder; Supplier 1: DigiKey; Supplier Part Number 1: WM5525-ND
C3 = 04025C102K4T2A: CAP CER 1000PF 50V X7R 0402; manufacturer: AVX Corporation; Tolerance: ±10%; Part Number: 04025C102K4T2A; Value: 1000pF; Applications: Automotive; Capacitance: 1000pF; componentlink1description: Datasheet; componentlink1url: http://datasheets.avx.com/AutoMLCC.pdf; componentlink2description: DigiKey Link; componentlink2url: http://digikey.com/product-detail/en/avx-corporation/04025C102K4T2A/478-11435-1-ND/8019290; Device Package: 0402 (1005 Metric); lastupdated: 8.02.2022 12:26:57; Lifecycle Status: Active; Minimum Order: 1; Mounting Type: Surface Mount, MLCC; Operating Temperature: -55°C ~ 125°C; Package / Case: 0402 (1005 Metric); packaging: TapeAndReel; partid: 2213; Part Status: Active; price: 0.02; Ratings: AEC-Q200; series: -; Size / Dimension: 0.039" L x 0.020" W (1.00mm x 0.50mm); Supplier 1: DigiKey; Supplier Part Number 1: 478-11435-1-ND; Temperature Coefficient: X7R; Thickness (Max): 0.022" (0.56mm); Voltage - Rated: 50V
C4 C5 = CC0402KRX7R8BB104: CAP CER 0.1UF 25V X7R 0402; manufacturer: Yageo; Tolerance: ±10%; Part Number: CC0402KRX7R8BB104; Value: 0.1 µF; Applications: General Purpose; Capacitance: 0.1 µF; componentlink1description: Datasheet; componentlink1url: https://www.yageo.com/upload/media/product/productsearch/datasheet/mlcc/UPY-GPHC_X7R_6.3V-to-50V_18.pdf; componentlink2description: DigiKey Link; componentlink2url: https://www.digikey.com/en/products/detail/yageo/CC0402KRX7R8BB104/5698946; Device Package: 0402 (1005 Metric); lastupdated: 27.02.2023 20:03:57; Lifecycle Status: Active; Minimum Order: 1; Mounting Type: Surface Mount, MLCC; Operating Temperature: -55°C ~ 125°C; Package / Case: 0402 (1005 Metric); packaging: TapeAndReel; partid: 12551; Part Status: Active; price: 0.01; series: CC; Size / Dimension: 0.039" L x 0.020" W (1.00mm x 0.50mm); Supplier 1: DigiKey; Supplier Part Number 1: 311-2077-1-ND; Temperature Coefficient: X7R; Thickness (Max): 0.022" (0.55mm); Voltage - Rated: 25V
C6 = GJM1555C1HR50BB01D: CAP CER 0.5PF 50V C0G/NP0 0402; manufacturer: Murata Electronics; Temperature Coefficient: C0G, NP0; Tolerance: ±0.1pF; Part Number: GJM1555C1HR50BB01D; Applications: RF, Microwave, High Frequency; Capacitance: 0.5 pF; componentlink1description: Datasheet; componentlink1url: https://search.murata.co.jp/Ceramy/image/img/A01X/G101/ENG/GJM1555C1HR50BB01-01.pdf; componentlink2description: DigiKey Link; componentlink2url: https://www.digikey.com/en/products/detail/murata-electronics/GJM1555C1HR50BB01D/2593250; Device Package: 0402 (1005 Metric); Features: High Q, Low Loss; lastupdated: 27.02.2023 20:04:06; Lifecycle Status: Active; Minimum Order: 1; Mounting Type: Surface Mount, MLCC; Operating Temperature: -55°C ~ 125°C; Package / Case: 0402 (1005 Metric); packaging: TapeAndReel; partid: 9579; Part Status: Active; price: 0.02; series: GJM; Size / Dimension: 0.039" L x 0.020" W (1.00mm x 0.50mm); Supplier 1: DigiKey; Supplier Part Number 1: 490-6077-1-ND; Thickness (Max): 0.022" (0.55mm); Voltage - Rated: 50V
C7 C8 C12 C13 = CL05B104KO5NNNC: as C47 on sheet Sensors; Part Number: CL05B104KO5NNNC; Applications: General Purpose; Capacitance: 0.1 µF; componentlink1description: Datasheet; componentlink1url: http://www.samsungsem.com/kr/support/product-search/mlcc/CL05B104KO5NNNC.jsp; componentlink2description: DigiKey Link; componentlink2url: https://www.digikey.com/en/products/detail/samsung-electro-mechanics/CL05B104KO5NNNC/3886659; Device Package: 0402 (1005 Metric); lastupdated: 27.02.2023 20:04:18; Lifecycle Status: Active; Minimum Order: 1; Mounting Type: Surface Mount, MLCC; Operating Temperature: -55°C ~ 125°C; Package / Case: 0402 (1005 Metric); packaging: CutTape; partid: 6066; Part Status: Active; price: 0.01; series: CL; Size / Dimension: 0.039" L x 0.020" W (1.00mm x 0.50mm); Supplier 1: DigiKey; Supplier Part Number 1: 1276-1001-1-ND; Temperature Coefficient: X7R; Thickness (Max): 0.022" (0.55mm); Voltage - Rated: 16V
C9 C11 = CC0402BRNPO9BN1R2: CAP CER 1.2PF 50V C0G/NPO 0402; manufacturer: Yageo; Temperature Coefficient: C0G, NP0; Tolerance: ±0.1pF; Part Number: CC0402BRNPO9BN1R2; Applications: General Purpose; Capacitance: 1.2 pF; componentlink1description: Datasheet; componentlink1url: https://www.yageo.com/upload/media/product/productsearch/datasheet/mlcc/UPY-GP_NP0_16V-to-50V_17.pdf; componentlink2description: DigiKey Link; componentlink2url: https://www.digikey.com/en/products/detail/yageo/CC0402BRNPO9BN1R2/5195024; Device Package: 0402 (1005 Metric); lastupdated: 27.02.2023 20:03:57; Lifecycle Status: Active; Minimum Order: 1; Mounting Type: Surface Mount, MLCC; Operating Temperature: -55°C ~ 125°C; Package / Case: 0402 (1005 Metric); packaging: TapeAndReel; partid: 12585; Part Status: Active; price: 0.01; series: CC; Size / Dimension: 0.039" L x 0.020" W (1.00mm x 0.50mm); Supplier 1: DigiKey; Supplier Part Number 1: 311-1615-1-ND; Thickness (Max): 0.022" (0.55mm); Voltage - Rated: 50V
  C9: Value: 1.2 pF
C10 = CC0402BRNPO9BNR80: CAP CER 0.8PF 50V C0G/NPO 0402; manufacturer: Yageo; Temperature Coefficient: C0G, NP0; Tolerance: ±0.1pF; Part Number: CC0402BRNPO9BNR80; Applications: General Purpose; Capacitance: 0.8 pF; componentlink1description: Datasheet; componentlink1url: https://www.yageo.com/upload/media/product/productsearch/datasheet/mlcc/UPY-GP_NP0_16V-to-50V_17.pdf; componentlink2description: DigiKey Link; componentlink2url: https://www.digikey.com/en/products/detail/yageo/CC0402BRNPO9BNR80/5883200; Device Package: 0402 (1005 Metric); lastupdated: 27.02.2023 20:04:11; Lifecycle Status: Active; Minimum Order: 1; Mounting Type: Surface Mount, MLCC; Operating Temperature: -55°C ~ 125°C; Package / Case: 0402 (1005 Metric); packaging: TapeAndReel; partid: 8101; Part Status: Active; price: 0.01; series: CC; Size / Dimension: 0.039" L x 0.020" W (1.00mm x 0.50mm); Supplier 1: DigiKey; Supplier Part Number 1: 311-3711-1-ND; Thickness (Max): 0.022" (0.55mm); Voltage - Rated: 50V
C14 = CL05A474KP5NNNC: CAP CER 0.47UF 10V X5R 0402; manufacturer: Samsung Electro-Mechanics; Tolerance: ±10%; Part Number: CL05A474KP5NNNC; Value: 0.47 µF; Applications: General Purpose; Capacitance: 0.47 µF; componentlink1description: Datasheet; componentlink1url: http://www.samsungsem.com/kr/support/product-search/mlcc/CL05A474KP5NNNC.jsp; componentlink2description: DigiKey Link; componentlink2url: https://www.digikey.com/en/products/detail/samsung-electro-mechanics/CL05A474KP5NNNC/3886831; Device Package: 0402 (1005 Metric); lastupdated: 27.02.2023 20:04:27; Lifecycle Status: Active; Minimum Order: 1; Mounting Type: Surface Mount, MLCC; Operating Temperature: -55°C ~ 85°C; Package / Case: 0402 (1005 Metric); packaging: TapeAndReel; partid: 3144; Part Status: Active; price: 0.01; series: CL; Size / Dimension: 0.039" L x 0.020" W (1.00mm x 0.50mm); Supplier 1: DigiKey; Supplier Part Number 1: 1276-1173-1-ND; Temperature Coefficient: X5R; Thickness (Max): 0.022" (0.55mm); Voltage - Rated: 10V
FB1 = MMZ1005Y400CT000: FERRITE BEAD 40 OHM 0402 1LN; Manufacturer: TDK Corporation; Current Rating (Max): 550mA; DC Resistance (DCR) (Max): 100mOhm; Filter Type: Signal Line; Number of Lines: 1; Part Number: MMZ1005Y400CT000; ComponentLink1Description: Datasheet; ComponentLink1URL: https://product.tdk.com/info/en/catalog/datasheets/beads_commercial_signal_mmz1005_en.pdf?ref_disty=digikey; ComponentLink2Description: DigiKey Link; ComponentLink2URL: https://www.digikey.com/en/products/detail/tdk-corporation/MMZ1005Y400CT000/604108; Device Package: 0402 (1005 Metric); Height (Max): 0.022" (0.55mm); Impedance @ Frequency: 40 Ohms @ 100 MHz; LastUpdated: 25.02.2023 20:48:26; Lifecycle Status: Active; Minimum Order: 1; Mounting Type: Surface Mount; Operating Temperature: -55°C ~ 125°C; Package / Case: 0402 (1005 Metric); Packaging: TapeAndReel; PartId: 480; Part Status: Active; Price: 0.02; Series: MMZ; Size / Dimension: 0.039" L x 0.020" W (1.00mm x 0.50mm); Supplier 1: DigiKey; Supplier Part Number 1: 445-2150-1-ND; Value: 40 Ohms @ 100 MHz
L1 L2 = LQW15AN3N0B80D: FIXED IND 3NH 1.35A 63 MOHM SMD; Manufacturer: Murata Electronics; DC Resistance (DCR): 63mOhm Max; Frequency - Self Resonant: 12.5GHz; Inductance Frequency - Test: 100 MHz; Material - Core: Non-Magnetic; Q @ Freq: 20 @ 250MHz; Shielding: Unshielded; Tolerance: ±0.1nH; Type: Wirewound; Part Number: LQW15AN3N0B80D; ComponentLink1Description: Datasheet; ComponentLink1URL: https://search.murata.co.jp/Ceramy/image/img/P02/JELF243A-0100.pdf; ComponentLink2Description: DigiKey Link; ComponentLink2URL: https://www.digikey.com/en/products/detail/murata-electronics/LQW15AN3N0B80D/4905926; Current Rating (Amps): 1.35 A; Device Package: 0402 (1005 Metric); Height - Seated (Max): 0.024" (0.60mm); Inductance: 3 nH; LastUpdated: 25.02.2023 21:01:34; Lifecycle Status: Active; Minimum Order: 1; Mounting Type: Surface Mount; Operating Temperature: -55°C ~ 125°C; Package / Case: 0402 (1005 Metric); Packaging: TapeAndReel; PartId: 4894; Part Status: Active; Price: 0.07; Series: LQW15; Size / Dimension: 0.039" L x 0.024" W (1.00mm x 0.60mm); Supplier 1: DigiKey; Supplier Part Number 1: 490-14712-1-ND; Value: 3 nH
L3 = Inductor_1: Inductor SMD; Code_IEC: 1005; Published: 8-Jun-2000; LatestRevisionDate: 05-oct-2007  -  Semtech; LatestRevisionNote: Re-released for DXP Platform.; Publisher: Altium Limited; Code_JEITA: 0402
R12 = CRCW04020000Z0ED: RES SMD 0 OHM JUMPER 1/16W 0402; Manufacturer: Vishay Dale; Power (Watts): 0.063W, 1/16W; Part Number: CRCW04020000Z0ED; ComponentLink1Description: Datasheet; ComponentLink1URL: http://www.vishay.com/docs/20035/dcrcwe3.pdf; ComponentLink2Description: DigiKey Link; ComponentLink2URL: http://digikey.com/product-detail/en/vishay-dale/CRCW04020000Z0ED/541-0.0JCT-ND/1182611; Composition: Thick Film; Device Package: 0402 (1005 Metric); Features: Automotive AEC-Q200; Height - Seated (Max): 0.016" (0.40mm); LastUpdated: 14.02.2022 15:03:58; Lifecycle Status: Active; Minimum Order: 1; Number of Terminations: 2; Operating Temperature: -55°C ~ 155°C; Package / Case: 0402 (1005 Metric); Packaging: CutTape; PartId: 17634; Part Status: Active; Price: 0.10; Ratings: AEC-Q200; Series: CRCW; Size / Dimension: 0.039" L x 0.020" W (1.00mm x 0.50mm); Supplier 1: DigiKey; Supplier Part Number 1: 541-0.0JCT-ND; Supplier Device Package: 0402; Tolerance: Jumper
U3 = SX1280: SX1280 - Ultra low power RF transceiver

## Nets that join several sheets
+3V3: MCU (8 pins), Power_Supply (34 pins), Sensors (20 pins), LoRa-SX1281 (C13.2 FB1.1 R12.1 U3.15)
+5V: MCU (6 pins), Power_Supply (13 pins)
GND: MCU (25 pins), Power_Supply (56 pins), Sensors (26 pins), LoRa-SX1281 (17 pins)
BOOT0: MCU (R11.1), Power_Supply (U1.138)
EXTINT: MCU (U1.20), Sensors (U6.4)
I2C1_SCA: MCU (U1.137), Power_Supply (U4.6), Sensors (U7.9 U9.16)
I2C1_SCL: MCU (U1.136), Power_Supply (U4.5), Sensors (U7.8 U9.1)
LNA_EN: MCU (U1.15), Sensors (U6.14)
MCU_NRST: MCU (R4.1), Power_Supply (C16.2 S1.1 S1.2 U1.25)
PA5: MCU (U1.41), LoRa-SX1281 (U3.18)
PB4: MCU (U1.134), LoRa-SX1281 (U3.16)
PB5: MCU (U1.135), LoRa-SX1281 (U3.17)
PF0: MCU (U1.10), Sensors (U10.6)
PF1: MCU (U1.11), Sensors (U10.1)
PF2: MCU (U1.12), Sensors (R25.1 U10.3)
PF9: MCU (U1.21), Sensors (U7.16)
PF10: MCU (U1.22), Sensors (U7.12)
PF11: MCU (U1.49), Sensors (U8.7)
PF12: MCU (U1.50), Sensors (U9.15)
PF13: MCU (U1.53), LoRa-SX1281 (U3.19)
SAFEBOOT_N: MCU (SW1.3), Sensors (U6.1)
USART2_RX: MCU (U1.37), Sensors (FB2.1)
USART2_TX: MCU (U1.119), Sensors (FB3.1)
VCC: Power_Supply (C31.2 R20.1 U5.16), Sensors (U8.1)